# Altium project EVO-PCB-R.PrjPcb
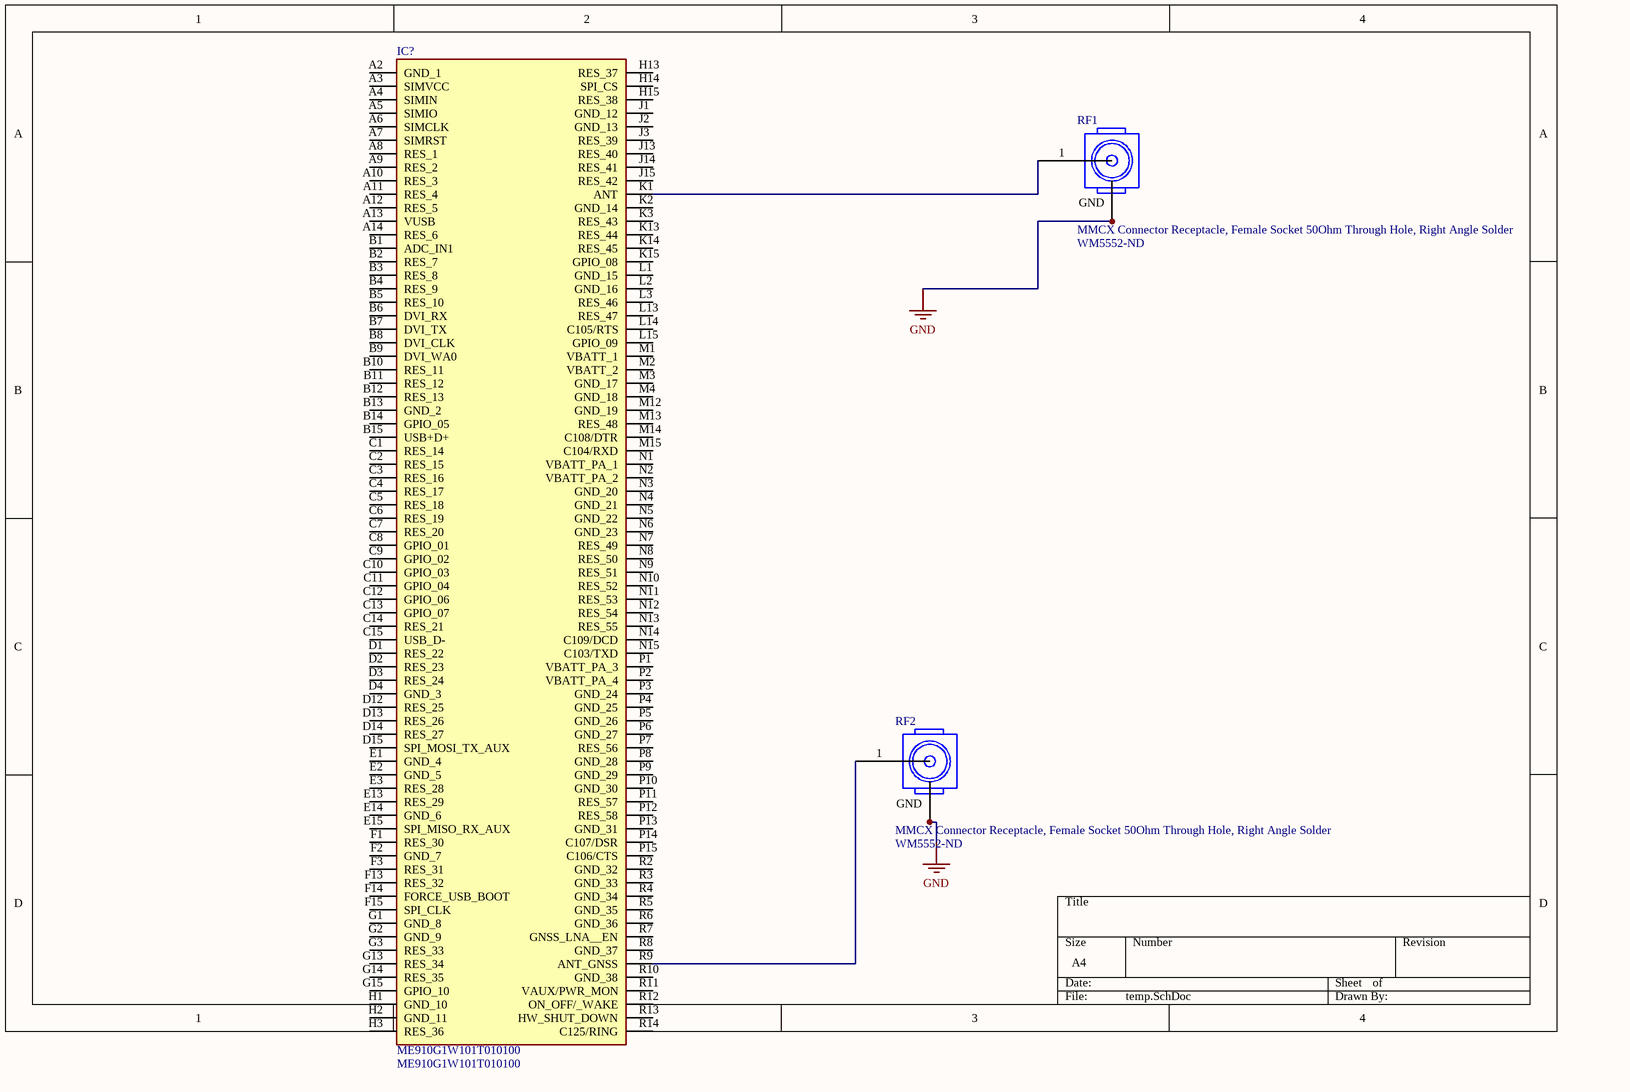
[diagram p0: temp.SchDoc]
1 sheet, 3 parts. Net scope: global (net labels, ports and power ports of the same name join across sheets).
Board file: PCB Radio.PcbDoc

## Sheet temp.SchDoc
size A4; SheetNumber: 1; SheetTotal: 1

### Parts
IC?  ME910G1W101T010100  [ME910G1]
RF1  MMCX Connector Receptacle, Female Socket 50Ohm Through Hole, Right Angle Solder  Supplier Part Number 1: WM5552-ND  [0734151001]
RF2  MMCX Connector Receptacle, Female Socket 50Ohm Through Hole, Right Angle Solder  Supplier Part Number 1: WM5552-ND  [0734151001]

### Nets
GND: RF1.2(G) RF1.3(G) RF1.4(G) RF1.5(G) RF2.2(G) RF2.3(G) RF2.4(G) RF2.5(G)
NetIC?_K1: IC?.K1(ANT) RF1.1
NetIC?_R9: IC?.R9(ANT_GNSS) RF2.1

Not connected (* = marked no-connect by the designer): IC? A2(GND_1) A3(SIMVCC) A4(SIMIN) A5(SIMIO) A6(SIMCLK) A7(SIMRST) A8(RES_1) A9(RES_2) A10(RES_3) A11(RES_4) A12(RES_5) A13(VUSB) A14(RES_6) B1(ADC_IN1) B2(RES_7) B3(RES_8) B4(RES_9) B5(RES_10) B6(DVI_RX) B7(DVI_TX) B8(DVI_CLK) B9(DVI_WA0) B10(RES_11) B11(RES_12) B12(RES_13) B13(GND_2) B14(GPIO_05) B15(USB+D+) C1(RES_14) C2(RES_15) C3(RES_16) C4(RES_17) C5(RES_18) C6(RES_19) C7(RES_20) C8(GPIO_01) C9(GPIO_02) C10(GPIO_03) C11(GPIO_04) C12(GPIO_06) C13(GPIO_07) C14(RES_21) C15(USB_D-) D1(RES_22) D2(RES_23) D3(RES_24) D4(GND_3) D12(RES_25) D13(RES_26) D14(RES_27) D15(SPI_MOSI_TX_AUX) E1(GND_4) E2(GND_5) E3(RES_28) E13(RES_29) E14(GND_6) E15(SPI_MISO_RX_AUX) F1(RES_30) F2(GND_7) F3(RES_31) F13(RES_32) F14(FORCE_USB_BOOT) F15(SPI_CLK) G1(GND_8) G2(GND_9) G3(RES_33) G13(RES_34) G14(RES_35) G15(GPIO_10) H1(GND_10) H2(GND_11) H3(RES_36) H13(RES_37) H14(SPI_CS) H15(RES_38) J1(GND_12) J2(GND_13) J3(RES_39) J13(RES_40) J14(RES_41) J15(RES_42) K2(GND_14) K3(RES_43) K13(RES_44) K14(RES_45) K15(GPIO_08) L1(GND_15) L2(GND_16) L3(RES_46) L13(RES_47) L14(C105/RTS) L15(GPIO_09) M1(VBATT_1) M2(VBATT_2) M3(GND_17) M4(GND_18) M12(GND_19) M13(RES_48) M14(C108/DTR) M15(C104/RXD) N1(VBATT_PA_1) N2(VBATT_PA_2) N3(GND_20) N4(GND_21) N5(GND_22) N6(GND_23) N7(RES_49) N8(RES_50) N9(RES_51) N10(RES_52) N11(RES_53) N12(RES_54) N13(RES_55) N14(C109/DCD) N15(C103/TXD) P1(VBATT_PA_3) P2(VBATT_PA_4) P3(GND_24) P4(GND_25) P5(GND_26) P6(GND_27) P7(RES_56) P8(GND_28) P9(GND_29) P10(GND_30) P11(RES_57) P12(RES_58) P13(GND_31) P14(C107/DSR) P15(C106/CTS) R2(GND_32) R3(GND_33) R4(GND_34) R5(GND_35) R6(GND_36) R7(GNSS_LNA__EN) R8(GND_37) R10(GND_38) R11(VAUX/PWR_MON) R12(ON_OFF/_WAKE) R13(HW_SHUT_DOWN) R14(C125/RING)

### Notes on the sheet
- (in symbol 0734151001) GND

### Library data of the parts
IC? = ME910G1W101T010100: Integrated Circuit; Manufacturer_Name: Telit Wireless Solutions; Datasheet Link: https://y1cj3stn5fbwhv73k0ipk1eg-wpengine.netdna-ssl.com/wp-content/uploads/2021/03/Telit_ME910G1_Hardware_Design_Guide_r8.pdf; Height: 2.55mm; Manufacturer_Part_Number: ME910G1W101T010100; Arrow Part Number: ME910G1W101T010100; Arrow Price/Stock: https://www.arrow.com/en/products/me910g1w101t010100/telit; Supplier 1: Arrow Electronics; Supplier Part Number 1: ME910G1W101T010100
RF1 RF2 = 0734151001: Supplier 1: Digi-Key